# Altium schematic sheet supply1.SchDoc: foxBMS BMS-Master
size A3; DocumentNumber: 3; SheetNumber: 3; SheetTotal: 24; Author: Fraunhofer IISB foxBMS Team; REL-DATE: 2017-05-16; VERSION: 1.0.2; SheetDescription: Supply for MCU1 and peripherals
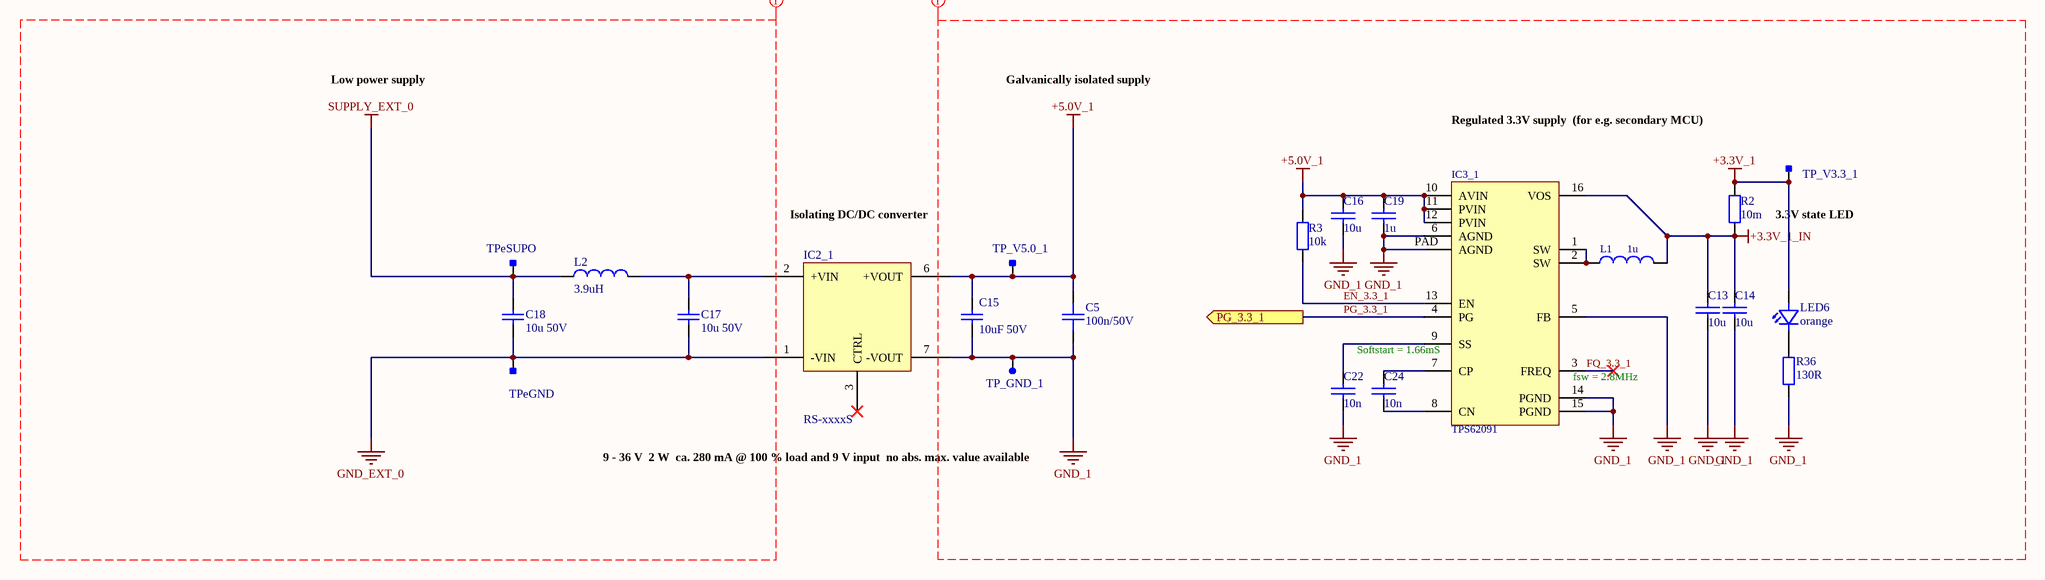
[diagram p0: supply1.SchDoc]

## Parts
C5  100n/50V  [0603C]
C13  10u  [0603C]
C14  10u  [0603C]
C15  10uF 50V  [CAPC3225X279X50LL20T25]
C16  10u  [0805C]
C17  10u 50V  [CAPC3225X279X50LL20T25]
C18  10u 50V  [CAPC3225X279X50LL20T25]
C19  1u  [0603C]
C22  10n  [0603C]
C24  10n  [0603C]
IC2_1  RS-xxxxS  [RECOM_RS-S_D]
IC3_1  TPS62091  [QFN-16-TI]
L1  1u  [WE-LQS]
L2  value 3.9uH  [INDC4532]  (hidden comment: FIXED IND 3.9UH 1.32A 140MOHM SM)
LED6  orange  [LEDC1608X07N]
R2  10m  [0805R]
R3  10k  [0603R]
R36  130R  [0603R]
TP_GND_1  Testpoint_Round  [Testpoint_D1V]  (value not drawn)  (no BOM)
TP_V3.3_1  Testpoint_Square  [Testpoint_S1]  (value not drawn)  (no BOM)
TP_V5.0_1  Testpoint_Square  [Testpoint_S1]  (value not drawn)  (no BOM)
TPeGND  Testpoint_Square  [Testpoint_S1]  (value not drawn)  (no BOM)
TPeSUPO  Testpoint_Square  [Testpoint_S1]  (value not drawn)  (no BOM)

## Ports
PG_3.3_1 (out)

## Nets
+3.3V_1: LED6.2(A) R2.1 TP_V3.3_1.1
+3.3V_1_IN: C13.1 C14.1 IC3_1.16(VOS) L1.2 R2.2
+5.0V_1: C5.1 C15.2 C16.1 C19.1 IC2_1.6(+VOUT) IC3_1.10(AVIN) IC3_1.11(PVIN) IC3_1.12(PVIN) R3.2 TP_V5.0_1.1
GND_1: C5.2 C13.2 C14.2 C15.1 C16.2 C19.2 C22.2 IC2_1.7(-VOUT) IC3_1.5(FB) IC3_1.6(AGND) IC3_1.14(PGND) IC3_1.15(PGND) IC3_1.PAD(AGND) R36.2 TP_GND_1.1
GND_EXT_0: C17.1 C18.1 IC2_1.1(-VIN) TPeGND.1
SUPPLY_EXT_0: C18.2 L2.1 TPeSUPO.1
EN_3.3_1: IC3_1.13(EN) R3.1
FQ_3.3_1: IC3_1.3(FREQ)
PG_3.3_1: IC3_1.4(PG) ; port PG_3.3_1
NetC17_2: C17.2 IC2_1.2(+VIN) L2.2
NetC22_1: C22.1 IC3_1.9(SS)
NetC24_1: C24.1 IC3_1.7(CP)
NetC24_2: C24.2 IC3_1.8(CN)
NetIC3_1_1: IC3_1.1(SW) IC3_1.2(SW) L1.1
NetLED6_1: LED6.1(C) R36.1

Not connected (* = marked no-connect by the designer): IC2_1 3(CTRL)*

## Layout directives
net class ISO_MCU_SEC: +3.3V_1, +3.3V_1_IN, +5.0V_1, EN_3.3_1, FQ_3.3_1, GND_1, PG_3.3_1
net class ISO_EXT: GND_EXT_0, SUPPLY_EXT_0

## Notes on the sheet
- Low power supply
- Galvanically isolated supply
- Regulated 3.3V supply
  (for e.g. secondary MCU)
- Isolating DC/DC converter
- 3.3V state LED
- (near IC3_1) Softstart = 1.66mS
- (near IC3_1) fsw = 2.8MHz
- 9 - 36 V
  2 W
  ca. 280 mA @ 100 % load and 9 V input
  no abs. max. value available
- Fraunhofer IISB
- Schottkystr. 10
- developed by:
- 91058 Erlangen
- Germany
- Author
- Project
- License
- Description
- File
- Version
- Release Date
- Sheet
- www.foxbms.org
- www.iisb.fraunhofer.de
- foxBMS Team
- /

## Library data of the parts
C5 = gen_C_ceramic_100n_50V_X7R_0603: MLCC; Capacitance: 100n; Rated Voltage: 50V; Dielectric: X7R; Case EIA: 0603; Case Metric: 1608; PnP Package: C_0603_10; PnP Value: 100n/50V/X7R; PnP equipped: x; Automotive Qualified: False; Part Number: gen_C_ceramic_100n_50V_X7R_0603; Supplier 1: Farnell; Supplier Part Number 1: 2525267; Supplier 2: Digikey; Supplier Part Number 2: 490-6049-1-ND
C13 C14 C16 = CAP: 10u 20% 6.3V 0603 X5R ceramic capacitor, RoHS compliant; ID: 11253; DBDesc: 10u 20% 6.3V 0603 X5R ceramic capacitor, RoHS compliant
C15 = CMP-2000-05480-1: Multilayer Ceramic Capacitor, 50 V, -55 to 125 degC, 2-Pin SMD (1210), RoHS, Tape and Reel; Manufacturer: AVX; Dielectric: X7R; Tolerance: 10%; Load Life: 1000h; Type: CommercialSurfaceMountChip; Temperature Coefficient / Code: +/-15%; Maximum Operating Temperature: +125C; Mounting Technology: SurfaceMount; Case Code - in: 1210; Package Description: 2-Pin Surface Mount Device, Body 3.2 x 2.5 mm; Datasheet URL: http://www.farnell.com/datasheets/1818074.pdf; Case Code - mm: 3225; Package / Case: 1210(3225metric); Product: GeneralTypeMLCCs; Capacitance: 10uF; Product Category: MultilayerCeramicCapacitorsMLCC-SMD/SMT; Minimum Operating Temperature: -55C; Manufacturer URL: http://www.avx.com/; Operating Temperature Range: -55Cto+125C; Termination Style: SMD/SMT; Voltage Rating: 50V; Factory Pack Quantity: 1000; RoHS: Details; Brand: AVX; Datasheet Version: 03/2014; Package Reference: 1210; Packaging: Reel; Voltage Rating DC: 50V
C17 C18 = CMP-2000-05480-1: Multilayer Ceramic Capacitor, 50 V, -55 to 125 degC, 2-Pin SMD (1210), RoHS, Tape and Reel; Manufacturer: AVX; Dielectric: X7R; Tolerance: 10%; Capacitance: 10uF; Load Life: 1000h; Type: CommercialSurfaceMountChip; Temperature Coefficient / Code: +/-15%; Maximum Operating Temperature: +125C; Mounting Technology: SurfaceMount; Case Code - in: 1210; Package Description: 2-Pin Surface Mount Device, Body 3.2 x 2.5 mm; Datasheet URL: http://www.farnell.com/datasheets/1818074.pdf; Case Code - mm: 3225; Package / Case: 1210(3225metric); Product: GeneralTypeMLCCs; Product Category: MultilayerCeramicCapacitorsMLCC-SMD/SMT; Minimum Operating Temperature: -55C; Manufacturer URL: http://www.avx.com/; Operating Temperature Range: -55Cto+125C; Termination Style: SMD/SMT; Voltage Rating: 50V; Factory Pack Quantity: 1000; RoHS: Details; Brand: AVX; Datasheet Version: 03/2014; Package Reference: 1210; Packaging: Reel; Voltage Rating DC: 50V
C19 = CAP: 10u 20% 6.3V 0603 X5R ceramic capacitor, RoHS compliant; DBDesc: 1u 10% 16V X5R 0402 ceramic capacitor, RoHS compliant; ID: 16358
C22 C24 = CAP: 10u 20% 6.3V 0603 X5R ceramic capacitor, RoHS compliant; DBDesc: 10n 10% 50V 0402 X7R ceramic capacitor, RoHS compliant; ID: 16887
IC2_1 = Recom_RS-2405SZ/H3: Isolating DC/DC Converter; Manufacturer: Recom; Automotive Qualified: False; Part Number: Recom_RS-2405SZ/H3; ComponentLink1Description: Datasheet; ComponentLink1URL: https://www.recom-power.com/pdf/Econoline/RS-S_D_Z.pdf; Supplier 1: Digikey; Supplier Part Number 1: 945-1552-5-ND; Supplier 2: Farnell; Supplier Part Number 2: 1893731; Supplier 3: Mouser; Supplier Part Number 3: 919-RS-2405SZ/H3
IC3_1 = TPS62090: '''TI TPS62091 Integrated Sync. Buck Converter''' / - fsw=1.4/2.8MHz / - Vin = 2.5-6V, Vout=3.3V, Iout=3A / - 3x3mm QFN-16, RoHS compliant; DBDesc: '''TI TPS62091 Integrated Sync. Buck Converter''' / - fsw=1.4/2.8MHz / - Vin = 2.5-6V, Vout=0.8-Vin, Iout=3A / - 3x3mm QFN-16, RoHS compliant; ID: 21555
L1 = INDUCTOR: 1u 3.8A 25mR 20% IFSC-1515 inductor, RoHS compliant; DBDesc: Wurth 74404042010, 1u 3.2A 27mR 30% inductor, RoHS compliant; ID: 25863
L2 = Inductor: 3.9µH Unshielded Wirewound Inductor 1.32A 140mOhm Max 1812 (4532 Metric); PartNumber: RLS-397; Code_IEC: 1005; Published: 8-Jun-2000; LatestRevisionDate: 29-May-2009; LatestRevisionNote: IPC-7351 Footprint Added.; PackageReference: 4532; Publisher: Altium Limited; PackageDescription: Chip Inductor; Code_JEITA: 4532
LED6 = gen_LED_0603_orange: LED; Breakdown Voltage: 5V; Continuous Forward Current: 20mA; Forward Voltage @ 20mA: 2.2V; Automotive Qualified: False; Part Number: gen_LED_0603_orange; Color: orange; PnP Package: LED_0603; Supplier 1: Farnell; Supplier Part Number 1: 2099222
R2 = Res2: Resistor; ID: 21805; DBDesc: 10m 0805 0-350ppm 5% 250mW current sense resistor, RoHS compliant
R3 = Res2: Resistor; ID: 13032; DBDesc: 10k 1% 63mW 0402 thick-film resistor, RoHS compliant
R36 = gen_R_130R_0603: SMD Resistor 130R 0603; Tolerance: 1%; Power: 0.1W; Case EIA: 0603; Case Metric: 1608; Maximum Working Voltage: 75V; PnP Package: R_0603; Automotive Qualified: False; Part Number: gen_R_130R_0603; Operating Temperature: -55°C - +155°C; Resistance: 130R; Series: E24, E96; PnP Value: 130R; Supplier 1: Farnell; Supplier Part Number 1: 2379959
TP_GND_1 = Testpoint_Round_Via: Testpoint, Via, round; Part Number: Testpoint_Round_Via
TP_V3.3_1 TP_V5.0_1 TPeGND TPeSUPO = Testpoint_Square: Testpoint, square; Part Number: Testpoint_Square